# Altium schematic sheet SpeedoMetr.SchDoc
size A4
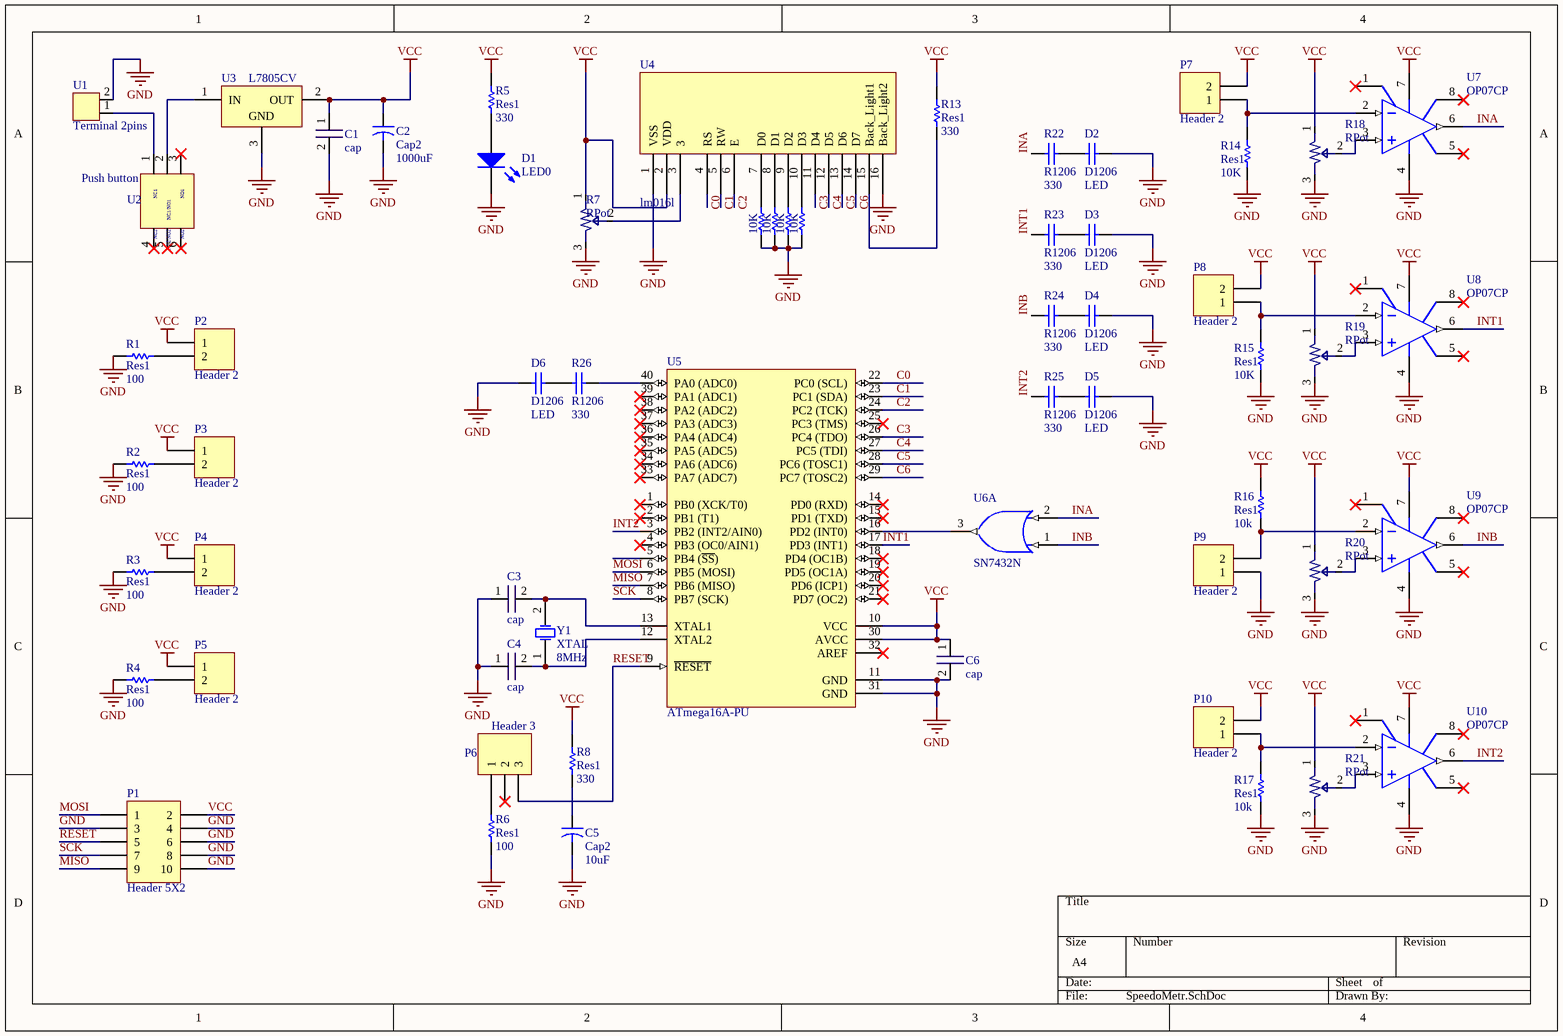
[diagram p0: SpeedoMetr.SchDoc]

## Parts
C1  cap  [cap 104]
C2  Cap2  value 1000uF  [RB]
C3  cap  [cap 104]
C4  cap  [cap 104]
C5  Cap2  value 10uF  [CAPPR5-5x5]
C6  cap  [cap 104]
D1  LED0  [LED-0]
D2  D1206  value LED  [1206]
D3  D1206  value LED  [1206]
D4  D1206  value LED  [1206]
D5  D1206  value LED  [1206]
D6  D1206  value LED  [1206]
P1  Header 5X2  [HDR2X5]
P2  Header 2  [HDR1X2]
P3  Header 2  [HDR1X2]
P4  Header 2  [HDR1X2]
P5  Header 2  [HDR1X2]
P6  Header 3  [HDR1X3]
P7  Header 2  [HDR1X2]
P8  Header 2  [HDR1X2]
P9  Header 2  [HDR1X2]
P10  Header 2  [HDR1X2]
R1  Res1  value 100  [AXIAL-0.3]
R2  Res1  value 100  [AXIAL-0.3]
R3  Res1  value 100  [AXIAL-0.3]
R4  Res1  value 100  [AXIAL-0.3]
R5  Res1  value 330  [AXIAL-0.3]
R6  Res1  value 100  [AXIAL-0.3]
R7  RPot  [PCBComponent_1]
R8  Res1  value 330  [AXIAL-0.3]
R9  value 10K  [AXIAL-0.3]  (hidden comment: Res1)
R10  value 10K  [AXIAL-0.3]  (hidden comment: Res1)
R11  value 10K  [AXIAL-0.3]  (hidden comment: Res1)
R12  value 10K  [AXIAL-0.3]  (hidden comment: Res1)
R13  Res1  value 330  [AXIAL-0.3]
R14  Res1  value 10K  [AXIAL-0.3]
R15  Res1  value 10K  [AXIAL-0.3]
R16  Res1  value 10k  [AXIAL-0.3]
R17  Res1  value 10k  [AXIAL-0.3]
R18  RPot  [PCBComponent_1]
R19  RPot  [PCBComponent_1]
R20  RPot  [PCBComponent_1]
R21  RPot  [PCBComponent_1]
R22  R1206  value 330  [1206]
R23  R1206  value 330  [1206]
R24  R1206  value 330  [1206]
R25  R1206  value 330  [1206]
R26  R1206  value 330  [1206]
U1  Terminal 2pins  [Terminal 2pins]
U2  Push button  [PCBComponent_1]
U3  L7805CV  [TO220ABN]
U4  lm016l  [PCBComponent_1]
U5  ATmega16A-PU  [40P6]
U6  SN7432N  [N014]  (part A of 4)
U7  OP07CP  [N-8_A]
U8  OP07CP  [N-8_A]
U9  OP07CP  [N-8_A]
U10  OP07CP  [N-8_A]
Y1  XTAL  value 8MHz  [XTAL]

## Nets
GND: C1.2 C2.2 C3.1 C4.1 C5.2 C6.2 D1.2(K) D2.2 D3.2 D4.2 D5.2 D6.2 P1.3 P1.4 P1.6 P1.8 P1.10 P9.1 R1.1 R2.1 R3.1 R4.1 R6.1 R7.3 R9.1 R10.1 R11.1 R12.1 R14.1 R15.1 R17.1 R18.3 R19.3 R20.3 R21.3 U1.2 U3.3(GND) U4.1(VSS) U4.16(Back_Light2) U5.11(GND) U5.31(GND) U6.7(GND) U7.4(V-) U8.4(V-) U9.4(V-) U10.4(V-)
VCC: C1.1 C2.1 C6.1 P1.2 P2.1 P3.1 P4.1 P5.1 P7.2 P8.2 P10.2 R5.1 R7.1 R8.2 R13.1 R16.2 R18.1 R19.1 R20.1 R21.1 U3.2(OUT) U4.2(VDD) U5.10(VCC) U5.30(AVCC) U6.14(VCC) U7.7(V+) U8.7(V+) U9.7(V+) U10.7(V+)
C0: U4.4(RS) U5.22(PC0_(SCL))
C1: U4.5(RW) U5.23(PC1_(SDA))
C2: U4.6(E) U5.24(PC2_(TCK))
C3: U4.11(D4) U5.26(PC4_(TDO))
C4: U4.12(D5) U5.27(PC5_(TDI))
C5: U4.13(D6) U5.28(PC6_(TOSC1))
C6: U4.14(D7) U5.29(PC7_(TOSC2))
INA: R22.1 U6.2(B) U7.6(OUT)
INB: R24.1 U6.1(A) U9.6(OUT)
INT1: R23.1 U5.17(PD3_(INT1)) U8.6(OUT)
INT2: R25.1 U5.3(PB2_(INT2/AIN0)) U10.6(OUT)
MISO: P1.9 U5.7(PB6_(MISO))
MOSI: P1.1 U5.6(PB5_(MOSI))
RESET: P1.5 P6.3 U5.9(~{RESET})
SCK: P1.7 U5.8(PB7_(SCK))
NetC3_2: C3.2 U5.13(XTAL1) Y1.2(OSC2)
NetC4_2: C4.2 U5.12(XTAL2) Y1.1(OSC1)
NetC5_1: C5.1 R8.1
NetD1_1: D1.1(A) R5.2
NetD2_1: D2.1 R22.2
NetD3_1: D3.1 R23.2
NetD4_1: D4.1 R24.2
NetD5_1: D5.1 R25.2
NetD6_1: D6.1 R26.2
NetP2_2: P2.2 R1.2
NetP3_2: P3.2 R2.2
NetP4_2: P4.2 R3.2
NetP5_2: P5.2 R4.2
NetP6_1: P6.1 R6.2
NetP7_1: P7.1 R14.2 U7.2(IN-)
NetP8_1: P8.1 R15.2 U8.2(IN-)
NetP9_2: P9.2 R16.1 U9.2(IN-)
NetP10_1: P10.1 R17.2 U10.2(IN-)
NetR7_2: R7.2 U4.3
NetR9_2: R9.2 U4.7(D0)
NetR10_2: R10.2 U4.8(D1)
NetR11_2: R11.2 U4.9(D2)
NetR12_2: R12.2 U4.10(D3)
NetR13_2: R13.2 U4.15(Back_Light1)
NetR18_2: R18.2 U7.3(IN+)
NetR19_2: R19.2 U8.3(IN+)
NetR20_2: R20.2 U9.3(IN+)
NetR21_2: R21.2 U10.3(IN+)
NetR26_1: R26.1 U5.40(PA0_(ADC0))
NetU1_1: U1.1 U2.1
NetU2_2: U2.2 U3.1(IN)
NetU5_16: U5.16(PD2_(INT0)) U6.3(Y)

Not connected (* = marked no-connect by the designer): P6 2*; U2 3* 4* 5* 6*; U5 1(PB0_(XCK/T0))* 2(PB1_(T1))* 4(PB3_(OC0/AIN1))* 5(PB4_(~{SS})) 14(PD0_(RXD))* 15(PD1_(TXD))* 18(PD4_(OC1B))* 19(PD5_(OC1A))* 20(PD6_(ICP1))* 21(PD7_(OC2))* 25(PC3_(TMS))* 32(AREF)* 33(PA7_(ADC7))* 34(PA6_(ADC6))* 35(PA5_(ADC5))* 36(PA4_(ADC4))* 37(PA3_(ADC3))* 38(PA2_(ADC2))* 39(PA1_(ADC1))*; U7 1(VOSTRIM)* 5(NC)* 8(VOSTRIM)*; U8 1(VOSTRIM)* 5(NC)* 8(VOSTRIM)*; U9 1(VOSTRIM)* 5(NC)* 8(VOSTRIM)*; U10 1(VOSTRIM)* 5(NC)* 8(VOSTRIM)*

## Notes on the sheet
- (in symbol Component_1) NC1; NO1; NC1/NO1; NC2; NC2/NO2; NO2

## Library data of the parts
C1 C3 C4 C6 = cap 104
C2 C5 = Cap2: Capacitor; Published: 23-Sep-2002; PackageReference: CAPR5-4X5; Publisher: Altium Limited; PackageDescription: Capacitor; 2 Leads
D1 = LED0: Typical INFRARED GaAs LED; Published: 8-Jun-2000; LatestRevisionDate: 08-Jul-2005; LatestRevisionNote: Mech Layer 1 removed.; PackageReference: LED-0; Publisher: Altium Limited; PackageDescription: LED; 2 Leads
D2-D6 R22-R26 = C1206: Ceramic Chip Capacitor - Standard; Published: 17-Jul-2002; LatestRevisionDate: 19-Mar-2004; LatestRevisionNote: Silkscreen size reduced.; DatasheetDocument: Mar-2001; PackageDocument: Mar-2001; PackageReference: 1206; Publisher: Altium Limited; Code_JEITA: 1206; Code_IPC: 3216 [1206]; ComponentLink1Description: Manufacturer Link; ComponentLink1URL: http://www.kemet.com/; ComponentLink2Description: Datasheet; ComponentLink2URL: http://www.kemet.com/kemet/web/homepage/kechome.nsf/vapubfilesname/F3102TA.pdf/$file/F3102TA.pdf
P1 = Header 5X2: Header, 5-Pin, Dual row; LatestRevisionDate: 17-Jul-2002; LatestRevisionNote: Re-released for DXP Platform.; Publisher: Altium Limited
P2-P5 P7-P10 = Header 2: Header, 2-Pin; LatestRevisionDate: 17-Jul-2002; LatestRevisionNote: Re-released for DXP Platform.; Publisher: Altium Limited
P6 = Header 3: Header, 3-Pin; LatestRevisionDate: 17-Jul-2002; LatestRevisionNote: Re-released for DXP Platform.; Publisher: Altium Limited
R1-R6 R8-R17 = Res1: Resistor; Published: 8-Jun-2000; LatestRevisionDate: 17-Jul-2002; LatestRevisionNote: Re-released for DXP Platform.; PackageReference: AXIAL-0.3; Publisher: Altium Limited; PackageDescription: Axial Device, Thru-Hole; 2 Leads; 0.3 in Pin Spacing
R7 R18-R21 = Component_1: Potentiometer
U1 = Terminal
U2 = Component_1: button
U3 = L7805CV: Positive Voltage Regulator; Note: Tab is connected to pin 3 (GND).; Published: 24-Aug-2001; LatestRevisionDate: 17-Jul-2002; LatestRevisionNote: Re-released for DXP Platform.; DatasheetVersion: Dec-1998; PackageVersion: Jun-1998; PackageReference: TO220ABN; Publisher: Altium Limited; PackageDescription: TO, Thru-Hole, Vertical, Heatsink Mounted; 3 In-Line Leads; Pitch 2.54 mm; Pin sequence 1, 3, 2; ComponentLink1Description: Manufacturer Link; ComponentLink1URL: http://www.st.com/
U4 = lm016l: LCD display
U5 = ATmega16A-PU: 8-bit AVR Microcontroller, 16KB Flash, 512 Bytes EEPROM, 1KB SRAM, 40-pin PDIP, Industrial Grade (-40°C to 85°C); Published: 1-Apr-2010; DatasheetVersion: revB, Jul-2009; PackageVersion: revB, Sep-2001; PackageReference: 40P6; Publisher: Altium Limited; PackageDescription: 40-lead (0.600"/15.24mm Wide) Plastic Dual Inline Package (PDIP); Supplier 1: Digi-Key; Supplier Part Number 1: ATMEGA16A-PU-ND; Supplier 2: Farnell; Supplier Part Number 2: 1704561; Supplier 3: Mouser; Supplier Part Number 3: 556-ATMEGA16A-PU; Code_JEDEC: MS-011-AC; ComponentLink1Description: Manufacturer Link; ComponentLink1URL: http://www.atmel.com/products/avr/default.asp?; ComponentLink2Description: ATmega16A Datasheet; ComponentLink2URL: http://www.atmel.com/dyn/resources/prod_documents/doc8154.pdf; ComponentLink3Description: ATmega16A Summary; ComponentLink3URL: http://www.atmel.com/dyn/resources/prod_documents/8154S.pdf; ComponentLink4Description: Atmel.com Home; ComponentLink4URL: http://www.atmel.com
U6 = SN7432N: Quadruple 2-Input Positive-OR Gate; Published: 8-Jun-2000; LatestRevisionDate: 04-Mar-2005; LatestRevisionNote: Stylized 3D Model Added.; DatasheetVersion: Mar-1988; PackageVersion: Oct-1995; PackageReference: N014; Publisher: Altium Limited; PackageDescription: DIP; 14 Leads; Row Spacing 7.62 mm; Pitch 2.54 mm; ComponentLink1Description: Manufacturer Link; ComponentLink1URL: http://www.ti.com/; ComponentLink2Description: Datasheet; ComponentLink2URL: http://www-s.ti.com/sc/ds/sn54ls32.pdf; ComponentLink3Description: Packaging Specification; ComponentLink3URL: http://focus.ti.com/lit/ml/mpdi002c/mpdi002c.pdf
U7-U10 = OP07CP: Ultra-Low Offset Voltage Operational Amplifier; Note: Pin 5 is not connected.; Published: 8-Jun-2000; LatestRevisionDate: 04-Mar-2005; LatestRevisionNote: Stylized 3D Model Added.; DatasheetVersion: 1992; PackageReference: N-8_A; Publisher: Altium Limited; PackageDescription: DIP; 8 Leads; Row Spacing 7.62 mm; Pitch 2.54 mm; Code_JEDEC: MO-001-AN; ComponentLink1Description: Manufacturer Link; ComponentLink1URL: http://www.analog.com/en/prod/0,,759_786_OP07%2C00.html; ComponentLink2Description: Datasheet; ComponentLink2URL: http://www.analog.com/UploadedFiles/Data_Sheets/39161232478959OP07_c.pdf
Y1 = XTAL: Crystal Oscillator; Designer: Meysam Parvizi; Email: meysam.parvizi.ir@gmail.com; Weblog: http://mp.tabin.ir